# EAGLE schematic lipo_charger (EAGLE 6.6.0)
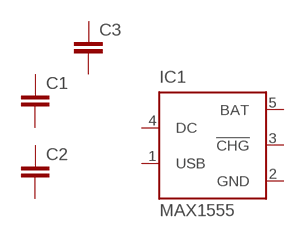
[diagram p0: schematic, sheet 1]

## Parts
C1  C-EUC0603  [C0603]
C2  C-EUC0603K  [C0603K]
C3  C-EUC0402  [C0402]
IC1  MAX1555  [SOT23-5L]
Unconnected: C1.1 C1.2 C2.1 C2.2 C3.1 C3.2 IC1.1(USB) IC1.3(!CHG) IC1.4(DC) IC1.5(BAT)

## Power pins joined to a net without a drawn wire
GND: IC1.2(GND)

## Library data of the parts
C1-C3 = resistor:C-EU: CAPACITOR, European symbol
IC1 = maxim:MAX1555: Dual-Input USB/AC Adapter 1-Cell Li+ Battery Chargers Source: http://www.maxim-ic.com .. MAX1551-MAX1555.pdf; MF: MAXIM; MPN: MAX1555EZK+T; OC_FARNELL: 1628222; OC_NEWARK: 59J2761